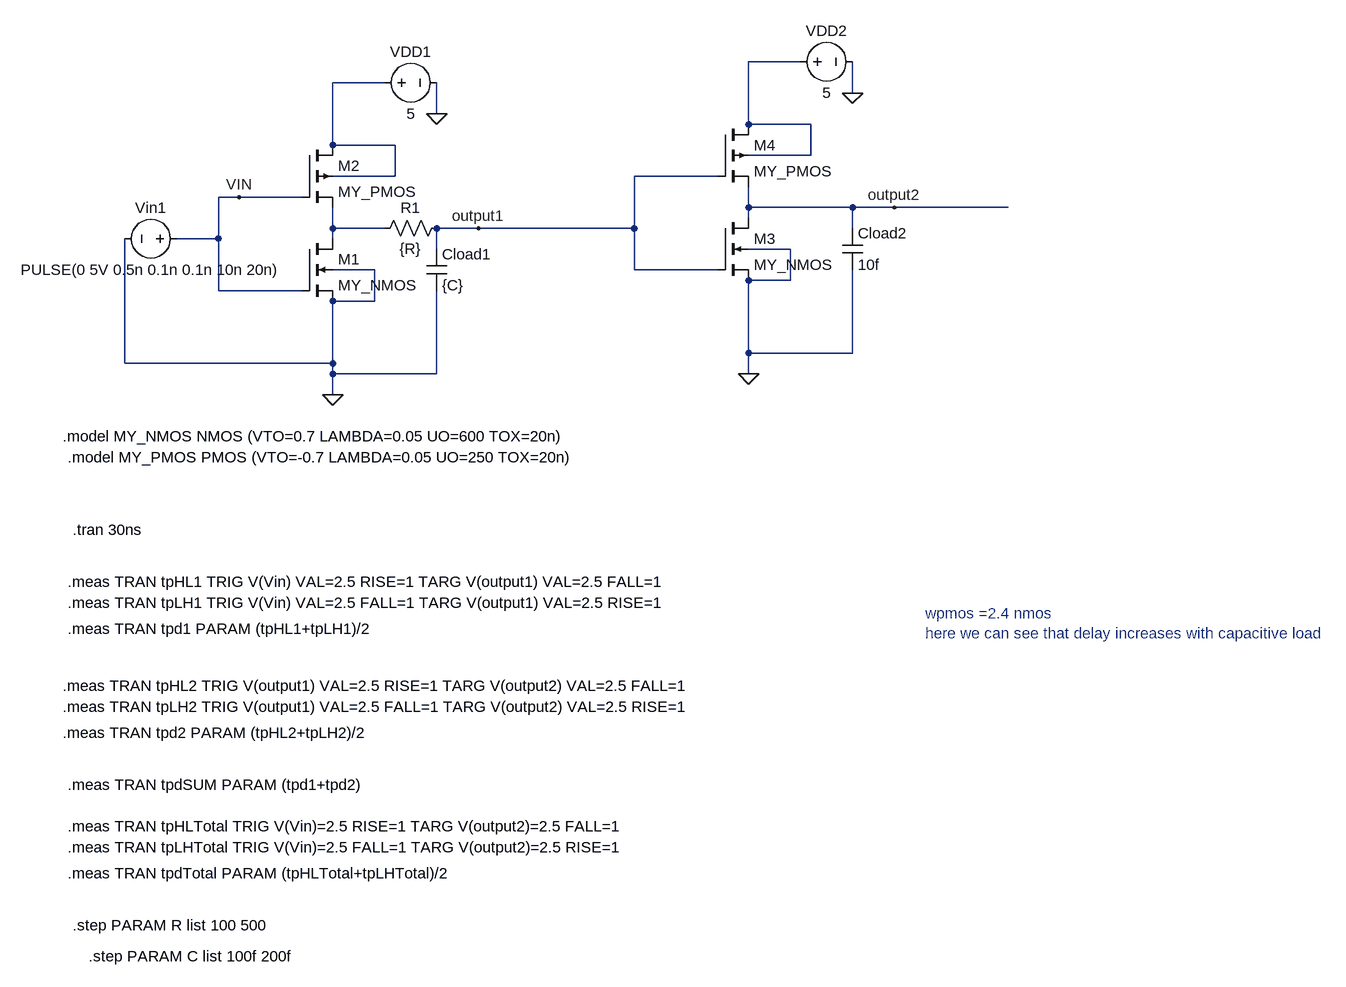
[diagram p0: schematic wire_Delay.asc]
wire_Delay.asc, the LTspice schematic file:
Version 4.1
SHEET 1 1324 1040
WIRE 464 -352 384 -352
WIRE -176 -320 -256 -320
WIRE 544 -304 544 -352
WIRE -96 -272 -96 -320
WIRE 384 -256 384 -352
WIRE 480 -256 384 -256
WIRE -256 -224 -256 -320
WIRE -160 -224 -256 -224
WIRE 480 -208 480 -256
WIRE 480 -208 384 -208
WIRE -160 -176 -160 -224
WIRE -160 -176 -256 -176
WIRE 336 -176 208 -176
WIRE -400 -144 -432 -144
WIRE -304 -144 -400 -144
WIRE 384 -128 384 -160
WIRE 544 -128 384 -128
WIRE 608 -128 544 -128
WIRE 784 -128 608 -128
WIRE 384 -112 384 -128
WIRE -256 -96 -256 -128
WIRE -176 -96 -256 -96
WIRE -32 -96 -96 -96
WIRE 208 -96 208 -176
WIRE 208 -96 -32 -96
WIRE 544 -96 544 -128
WIRE -432 -80 -432 -144
WIRE -432 -80 -496 -80
WIRE -256 -80 -256 -96
WIRE -96 -64 -96 -96
WIRE 448 -64 384 -64
WIRE -192 -32 -256 -32
WIRE 208 -32 208 -96
WIRE 336 -32 208 -32
WIRE 448 -16 448 -64
WIRE 448 -16 384 -16
WIRE -432 0 -432 -80
WIRE -304 0 -432 0
WIRE -192 16 -192 -32
WIRE -192 16 -256 16
WIRE 384 96 384 -16
WIRE 544 96 544 -32
WIRE 544 96 384 96
WIRE -576 112 -576 -80
WIRE -256 112 -256 16
WIRE -256 112 -576 112
WIRE -256 128 -256 112
WIRE -96 128 -96 0
WIRE -96 128 -256 128
WIRE 384 128 384 96
WIRE -256 160 -256 128
FLAG -256 160 0
FLAG -96 -272 0
FLAG -32 -96 output1
FLAG 384 128 0
FLAG 544 -304 0
FLAG 608 -128 output2
FLAG -400 -144 VIN
SYMBOL nmos4 -304 -80 R0
SYMATTR InstName M1
SYMATTR Value MY_NMOS
SYMATTR Value2 l=1u w=1u
SYMBOL voltage -480 -80 R90
WINDOW 0 -32 56 VBottom 2
WINDOW 3 32 56 VTop 2
WINDOW 123 0 0 Left 0
WINDOW 39 0 0 Left 0
SYMATTR InstName Vin1
SYMATTR Value PULSE(0 5V 0.5n 0.1n 0.1n 10n 20n)
SYMBOL voltage -192 -320 R270
WINDOW 0 32 56 VTop 2
WINDOW 3 -32 56 VBottom 2
WINDOW 123 0 0 Left 0
WINDOW 39 0 0 Left 0
SYMATTR InstName VDD1
SYMATTR Value 5
SYMBOL cap -112 -64 R0
SYMATTR InstName Cload1
SYMATTR Value {C}
SYMBOL pmos4 -304 -224 R0
SYMATTR InstName M2
SYMATTR Value MY_PMOS
SYMATTR Value2 l=1u w=2.4u
SYMBOL nmos4 336 -112 R0
SYMATTR InstName M3
SYMATTR Value MY_NMOS
SYMATTR Value2 l=1u w=1u
SYMBOL voltage 448 -352 R270
WINDOW 0 32 56 VTop 2
WINDOW 3 -32 56 VBottom 2
WINDOW 123 0 0 Left 0
WINDOW 39 0 0 Left 0
SYMATTR InstName VDD2
SYMATTR Value 5
SYMBOL cap 528 -96 R0
SYMATTR InstName Cload2
SYMATTR Value 10f
SYMBOL pmos4 336 -256 R0
SYMATTR InstName M4
SYMATTR Value MY_PMOS
SYMATTR Value2 l=1u w=2.4u
SYMBOL res -80 -112 R90
WINDOW 0 0 56 VBottom 2
WINDOW 3 32 56 VTop 2
SYMATTR InstName R1
SYMATTR Value {R}
TEXT -672 224 Left 2 !.model MY_NMOS NMOS (VTO=0.7 LAMBDA=0.05 UO=600 TOX=20n)
TEXT -664 256 Left 2 !.model MY_PMOS PMOS (VTO=-0.7 LAMBDA=0.05 UO=250 TOX=20n)
TEXT -656 368 Left 2 !.tran 30ns
TEXT -664 448 Left 2 !.meas TRAN tpHL1 TRIG V(Vin) VAL=2.5 RISE=1 TARG V(output1) VAL=2.5 FALL=1
TEXT -664 480 Left 2 !.meas TRAN tpLH1 TRIG V(Vin) VAL=2.5 FALL=1 TARG V(output1) VAL=2.5 RISE=1
TEXT -664 520 Left 2 !.meas TRAN tpd1 PARAM (tpHL1+tpLH1)/2
TEXT 656 496 Left 2 ;wpmos =2.4 nmos\nhere we can see that delay increases with capacitive load
TEXT -672 608 Left 2 !.meas TRAN tpHL2 TRIG V(output1) VAL=2.5 RISE=1 TARG V(output2) VAL=2.5 FALL=1
TEXT -672 640 Left 2 !.meas TRAN tpLH2 TRIG V(output1) VAL=2.5 FALL=1 TARG V(output2) VAL=2.5 RISE=1
TEXT -672 680 Left 2 !.meas TRAN tpd2 PARAM (tpHL2+tpLH2)/2
TEXT -664 760 Left 2 !.meas TRAN tpdSUM PARAM (tpd1+tpd2)
TEXT -664 824 Left 2 !.meas TRAN tpHLTotal TRIG V(Vin)=2.5 RISE=1 TARG V(output2)=2.5 FALL=1
TEXT -664 856 Left 2 !.meas TRAN tpLHTotal TRIG V(Vin)=2.5 FALL=1 TARG V(output2)=2.5 RISE=1
TEXT -664 896 Left 2 !.meas TRAN tpdTotal PARAM (tpHLTotal+tpLHTotal)/2
TEXT -656 976 Left 2 !.step PARAM R list 100 500
TEXT -632 1024 Left 2 !.step PARAM C list 100f 200f

The netlist it stands for:
* wire_Delay.asc
M1 N003 VIN 0 0 MY_NMOS l=1u w=1u
Vin1 VIN 0 PULSE(0 5V 0.5n 0.1n 0.1n 10n 20n)
VDD1 N002 0 5
Cload1 output1 0 {C}
M2 N002 VIN N003 N002 MY_PMOS l=1u w=2.4u
M3 output2 output1 0 0 MY_NMOS l=1u w=1u
VDD2 N001 0 5
Cload2 output2 0 10f
M4 N001 output1 output2 N001 MY_PMOS l=1u w=2.4u
R1 output1 N003 {R}
.model NMOS NMOS
.model PMOS PMOS
.lib standard.mos
.model MY_NMOS NMOS (VTO=0.7 LAMBDA=0.05 UO=600 TOX=20n)
.model MY_PMOS PMOS (VTO=-0.7 LAMBDA=0.05 UO=250 TOX=20n)
.tran 30ns
.meas TRAN tpHL1 TRIG V(Vin) VAL=2.5 RISE=1 TARG V(output1) VAL=2.5 FALL=1
.meas TRAN tpLH1 TRIG V(Vin) VAL=2.5 FALL=1 TARG V(output1) VAL=2.5 RISE=1
.meas TRAN tpd1 PARAM (tpHL1+tpLH1)/2
* wpmos =2.4 nmos
* here we can see that delay increases with capacitive load
.meas TRAN tpHL2 TRIG V(output1) VAL=2.5 RISE=1 TARG V(output2) VAL=2.5 FALL=1
.meas TRAN tpLH2 TRIG V(output1) VAL=2.5 FALL=1 TARG V(output2) VAL=2.5 RISE=1
.meas TRAN tpd2 PARAM (tpHL2+tpLH2)/2
.meas TRAN tpdSUM PARAM (tpd1+tpd2)
.meas TRAN tpHLTotal TRIG V(Vin)=2.5 RISE=1 TARG V(output2)=2.5 FALL=1
.meas TRAN tpLHTotal TRIG V(Vin)=2.5 FALL=1 TARG V(output2)=2.5 RISE=1
.meas TRAN tpdTotal PARAM (tpHLTotal+tpLHTotal)/2
.step PARAM R list 100 500
.step PARAM C list 100f 200f
.backanno
.end